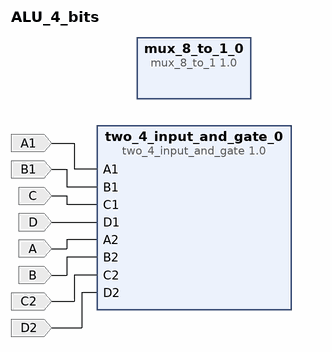
[diagram p0: block diagram of the top level]
# Vivado block design ALU_4_bits, xc7a35tcpg236-1, Vivado 2017.2
create_bd_design ALU_4_bits

create_bd_port -dir I A1
create_bd_port -dir I B1
create_bd_port -dir I C
create_bd_port -dir I D
create_bd_port -dir I A
create_bd_port -dir I B
create_bd_port -dir I C2
create_bd_port -dir I D2

create_bd_cell -type ip -vlnv xilinx.com:xup:mux_8_to_1:1.0 mux_8_to_1_0
create_bd_cell -type ip -vlnv xilinx.com:XUP:two_4_input_and_gate:1.0 two_4_input_and_gate_0

# ---- connections ----

connect_bd_net -net A1_1 [get_bd_ports A1] [get_bd_pins two_4_input_and_gate_0/A1]
connect_bd_net -net B1_1 [get_bd_ports B1] [get_bd_pins two_4_input_and_gate_0/B1]
connect_bd_net -net C1_1 [get_bd_ports C] [get_bd_pins two_4_input_and_gate_0/C1]
connect_bd_net -net D1_1 [get_bd_ports D] [get_bd_pins two_4_input_and_gate_0/D1]
connect_bd_net -net A2_1 [get_bd_ports A] [get_bd_pins two_4_input_and_gate_0/A2]
connect_bd_net -net B2_1 [get_bd_ports B] [get_bd_pins two_4_input_and_gate_0/B2]
connect_bd_net -net C2_1 [get_bd_ports C2] [get_bd_pins two_4_input_and_gate_0/C2]
connect_bd_net -net D2_1 [get_bd_ports D2] [get_bd_pins two_4_input_and_gate_0/D2]

validate_bd_design
save_bd_design
